# Altium schematic sheet Brain-PCB_Master.SchDoc
size C; SheetNumber: 1; SheetTotal: 1
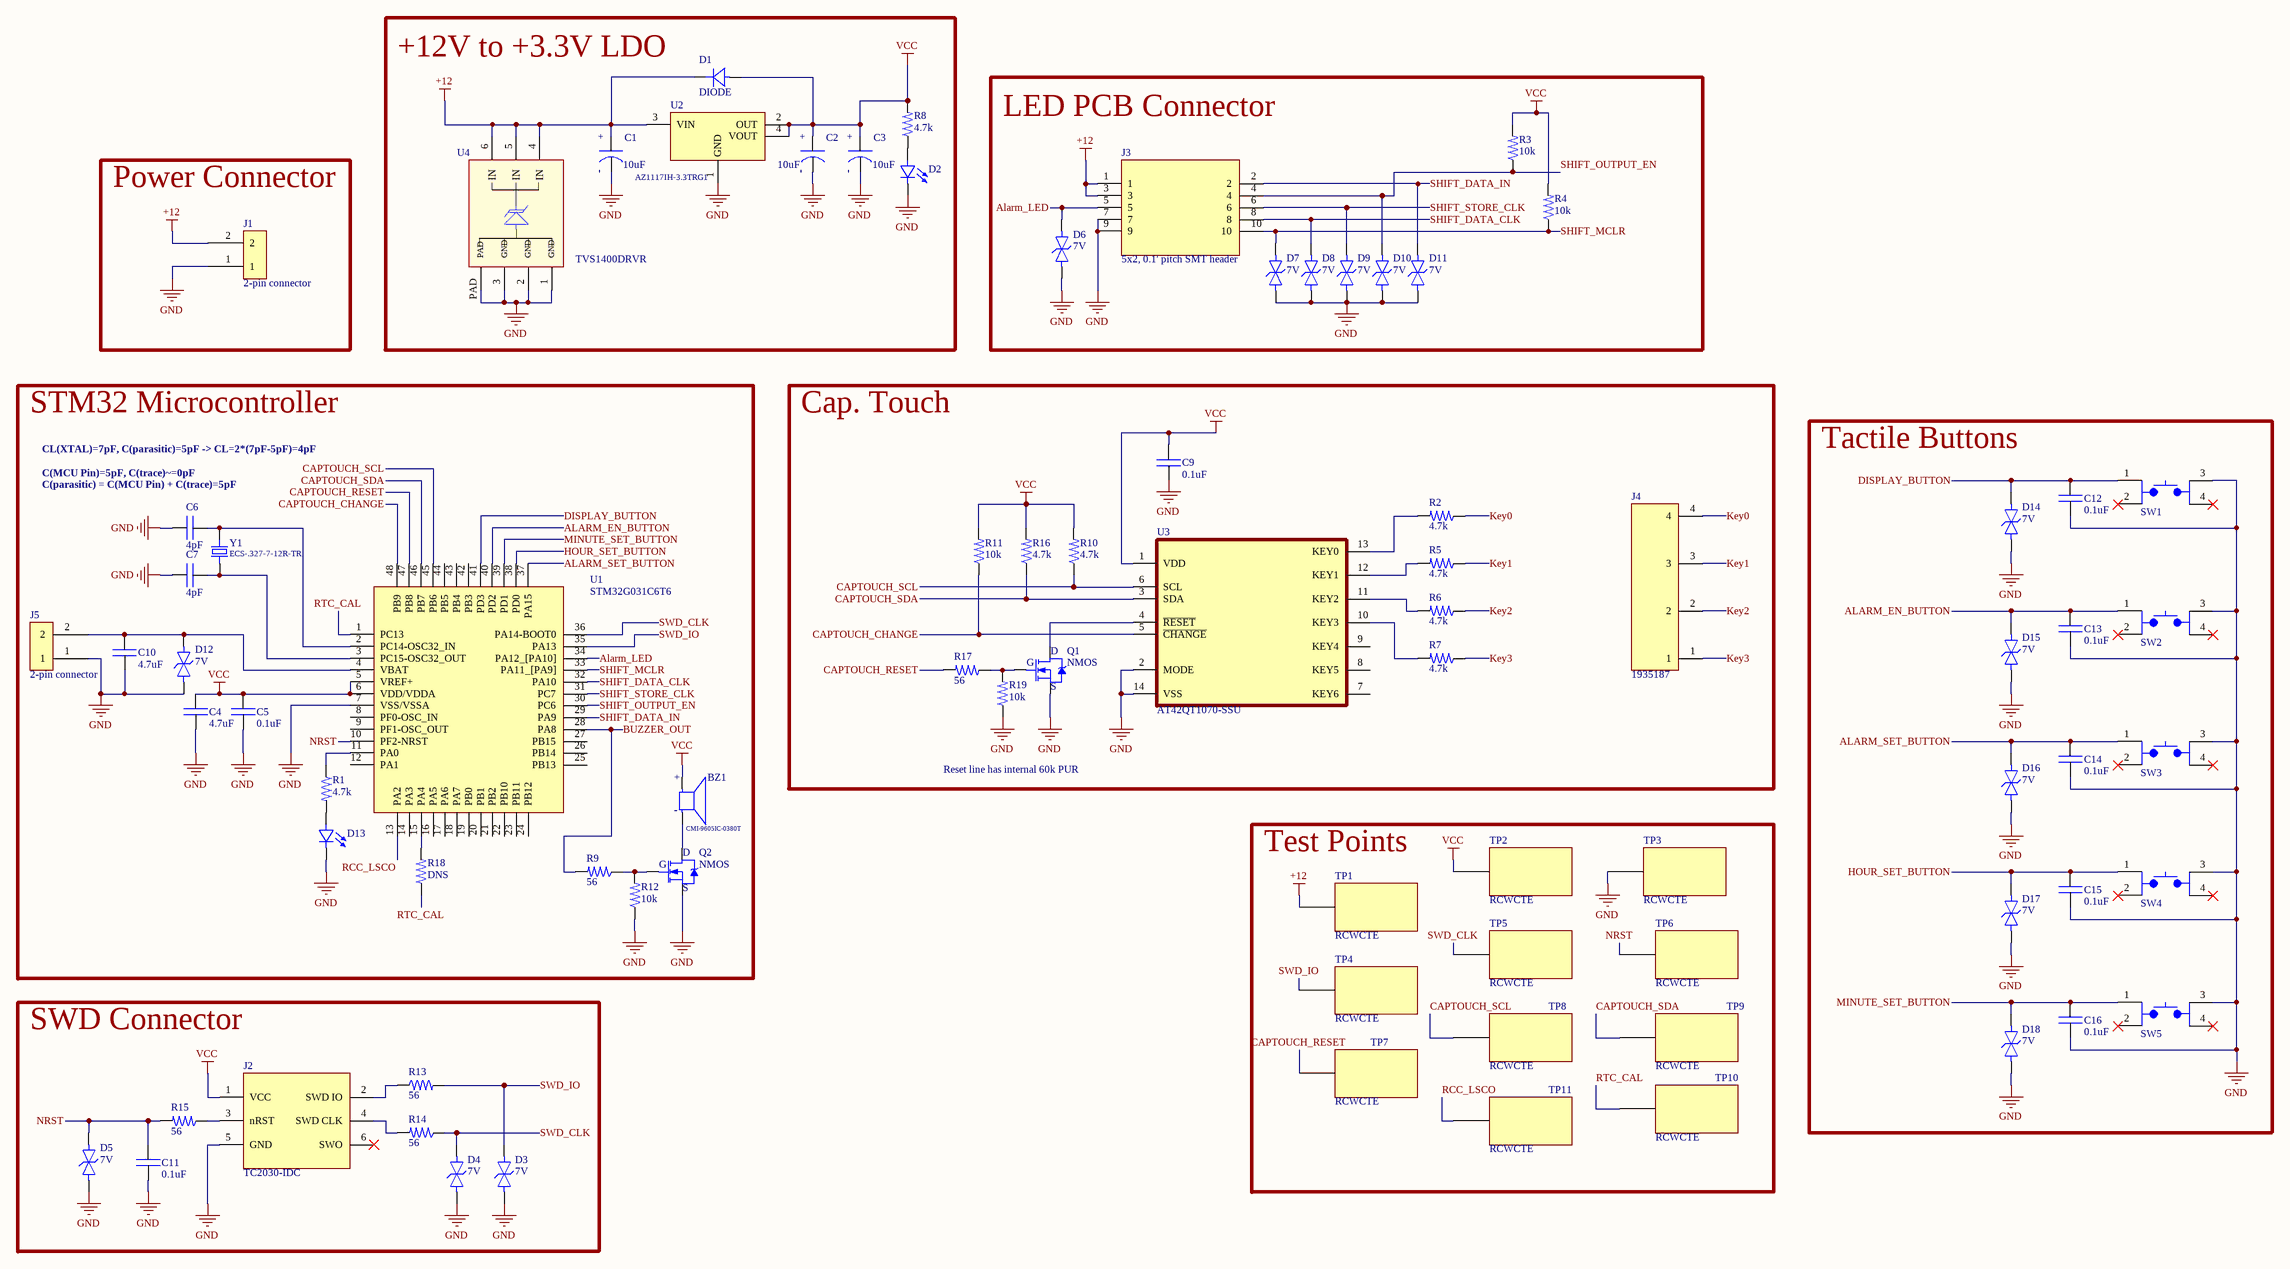
[diagram p0: Brain-PCB_Master.SchDoc]

## Parts
BZ1  CMI-9605IC-0380T  [CUI_CMI-9605IC-0380T]
C1  value 10uF  [CAP_CAN_POLY]  (hidden comment: CAP)
C2  value 10uF  [CAP_CAN_POLY]  (hidden comment: CAP)
C3  value 10uF  [CAP_CAN_POLY]  (hidden comment: CAP)
C4  value 4.7uF  [0402C]  (hidden comment: CAP)
C5  value 0.1uF  [0402C]  (hidden comment: CAP)
C6  value 4pF  [0402C]  (hidden comment: CAP)
C7  value 4pF  [0402C]  (hidden comment: CAP)
C9  value 0.1uF  [0402C]  (hidden comment: CAP)
C10  value 4.7uF  [0402C]  (hidden comment: CAP)
C11  value 0.1uF  [0402C]  (hidden comment: CAP)
C12  value 0.1uF  [0402C]  (hidden comment: CAP)
C13  value 0.1uF  [0402C]  (hidden comment: CAP)
C14  value 0.1uF  [0402C]  (hidden comment: CAP)
C15  value 0.1uF  [0402C]  (hidden comment: CAP)
C16  value 0.1uF  [0402C]  (hidden comment: CAP)
D1  DIODE  [DO-214AC]
D2  LED - single  [LED - 0603]  (value not drawn)
D3  7V  [DESD3V3S1BL-7B]
D4  7V  [DESD3V3S1BL-7B]
D5  7V  [DESD3V3S1BL-7B]
D6  7V  [DESD3V3S1BL-7B]
D7  7V  [DESD3V3S1BL-7B]
D8  7V  [DESD3V3S1BL-7B]
D9  7V  [DESD3V3S1BL-7B]
D10  7V  [DESD3V3S1BL-7B]
D11  7V  [DESD3V3S1BL-7B]
D12  7V  [DESD3V3S1BL-7B]
D13  LED - single  [LED - 0603]  (value not drawn)
D14  7V  [DESD3V3S1BL-7B]
D15  7V  [DESD3V3S1BL-7B]
D16  7V  [DESD3V3S1BL-7B]
D17  7V  [DESD3V3S1BL-7B]
D18  7V  [DESD3V3S1BL-7B]
J1  2-pin connector  [CONN_MOLEX_705510001]
J2  TC2030-IDC  [TAG CONNECT TC2030IDC - NO 3D MODEL]
J3  5x2, 0.1' pitch SMT header  [5x2, 0.1' pitch SMT header]
J4  1935187  [1935187]
J5  2-pin connector  [CONN_MOLEX_705510001]
Q1  NMOS  [SOT-23]
Q2  NMOS  [SOT-23]
R1  value 4.7k  [0402R]  (hidden comment: RES)
R2  value 4.7k  [0402R]  (hidden comment: RES)
R3  value 10k  [0402R]  (hidden comment: RES)
R4  value 10k  [0402R]  (hidden comment: RES)
R5  value 4.7k  [0402R]  (hidden comment: RES)
R6  value 4.7k  [0402R]  (hidden comment: RES)
R7  value 4.7k  [0402R]  (hidden comment: RES)
R8  value 4.7k  [0402R]  (hidden comment: RES)
R9  value 56  [0402R]  (hidden comment: RES)
R10  value 4.7k  [0402R]  (hidden comment: RES)
R11  value 10k  [0402R]  (hidden comment: RES)
R12  value 10k  [0402R]  (hidden comment: RES)
R13  value 56  [0402R]  (hidden comment: RES)
R14  value 56  [0402R]  (hidden comment: RES)
R15  value 56  [0402R]  (hidden comment: RES)
R16  value 4.7k  [0402R]  (hidden comment: RES)
R17  value 56  [0402R]  (hidden comment: RES)
R18  value DNS  [0402R]  (hidden comment: RES)
R19  value 10k  [0402R]  (hidden comment: RES)
SW1  SPDT SMT Tactile Push Button Switch  [TL3301BF160QGTUBE]  (value not drawn)
SW2  SPDT SMT Tactile Push Button Switch  [TL3301BF160QGTUBE]  (value not drawn)
SW3  SPDT SMT Tactile Push Button Switch  [TL3301BF160QGTUBE]  (value not drawn)
SW4  SPDT SMT Tactile Push Button Switch  [TL3301BF160QGTUBE]  (value not drawn)
SW5  SPDT SMT Tactile Push Button Switch  [TL3301BF160QGTUBE]  (value not drawn)
TP1  RCWCTE  [RCWCTE]
TP2  RCWCTE  [RCWCTE]
TP3  RCWCTE  [RCWCTE]
TP4  RCWCTE  [RCWCTE]
TP5  RCWCTE  [RCWCTE]
TP6  RCWCTE  [RCWCTE]
TP7  RCWCTE  [RCWCTE]
TP8  RCWCTE  [RCWCTE]
TP9  RCWCTE  [RCWCTE]
TP10  RCWCTE  [RCWCTE]
TP11  RCWCTE  [RCWCTE]
U1  STM32G031C6T6  [48-LQFP]
U2  AZ1117IH-3.3TRG1  [SOT-223-3]
U3  AT42QT1070-SSU  [14-SOIC]
U4  TVS1400DRVR  [6-WDFN-EP]
Y1  ECS-.327-7-12R-TR  [ECS-.327-12.5-12R-TR]

## Blocks framed on the sheet
+12V to +3.3V LDO: C1-C3 D1 D2 R8 U2 U4
LED PCB Connector: D6-D11 J3 R3 R4
Power Connector: J1
STM32 Microcontroller: BZ1 C4-C7 C10 D12 D13 J5 Q2 R1 R9 R12 R18 U1 Y1
Cap. Touch: C9 J4 Q1 R2 R5-R7 R10 R11 R16 R17 R19 U3
Tactile Buttons: C12-C16 D14-D18 SW1-SW5
Test Points: TP1-TP11
SWD Connector: C11 D3-D5 J2 R13-R15

## Nets
+12: C1.1 D1.K J1.2 J3.1 J3.3 TP1.1 U2.3(VIN) U4.4(IN) U4.5(IN) U4.6(IN)
GND: C1.2 C2.2 C3.2 C4.1 C5.1 C6.1 C7.1 C9.1 C10.1 C11.1 C12.1 C13.1 C14.1 C15.1 C16.1 D2.2(C) D3.2 D4.2 D5.2 D6.2 D7.2 D8.2 D9.2 D10.2 D11.2 D12.2 D13.2(C) D14.2 D15.2 D16.2 D17.2 D18.2 J1.1 J2.5(GND) J3.7 J3.9 J5.1 Q1.2(S) Q2.2(S) R12.1 R19.1 SW1.3 SW2.3 SW3.3 SW4.3 SW5.3 TP3.1 U1.7(VSS/VSSA) U2.1(GND) U3.2(MODE) U3.14(VSS) U4.1(GND) U4.2(GND) U4.3(GND) U4.PAD
VCC: BZ1.P C2.1 C3.1 C4.2 C5.2 C9.2 D1.A J2.1(VCC) R3.2 R4.2 R8.2 R10.2 R11.2 R16.2 TP2.1 U1.5(VREF+) U1.6(VDD/VDDA) U2.2(OUT) U2.4(VOUT) U3.1(VDD)
ALARM_EN_BUTTON: C13.2 D15.1 SW2.1 U1.40(PD2)
Alarm_LED: D6.1 J3.5 U1.34(PA12_[PA10])
ALARM_SET_BUTTON: C14.2 D16.1 SW3.1 U1.37(PA15)
BUZZER_OUT: R9.2 U1.28(PA8)
CAPTOUCH_CHANGE: R11.1 U1.48(PB9) U3.5(~{CHANGE})
CAPTOUCH_RESET: R17.2 TP7.1 U1.47(PB8)
CAPTOUCH_SCL: R10.1 TP8.1 U1.45(PB6) U3.6(SCL)
CAPTOUCH_SDA: R16.1 TP9.1 U1.46(PB7) U3.3(SDA)
DISPLAY_BUTTON: C12.2 D14.1 SW1.1 U1.41(PD3)
HOUR_SET_BUTTON: C15.2 D17.1 SW4.1 U1.38(PD0)
Key0: J4.4 R2.1
Key1: J4.3 R5.1
Key2: J4.2 R6.1
Key3: J4.1 R7.1
MINUTE_SET_BUTTON: C16.2 D18.1 SW5.1 U1.39(PD1)
NRST: C11.2 D5.1 R15.2 TP6.1 U1.10(PF2-NRST)
RCC_LSCO: TP11.1 U1.13(PA2)
RTC_CAL: R18.1 TP10.1 U1.1(PC13)
SHIFT_DATA_CLK: D8.1 J3.8 U1.32(PA10)
SHIFT_DATA_IN: D11.1 J3.2 U1.29(PA9)
SHIFT_MCLR: D7.1 J3.10 R4.1 U1.33(PA11_[PA9])
SHIFT_OUTPUT_EN: D10.1 J3.4 R3.1 U1.30(PC6)
SHIFT_STORE_CLK: D9.1 J3.6 U1.31(PC7)
SWD_CLK: D4.1 R14.1 TP5.1 U1.36(PA14-BOOT0)
SWD_IO: D3.1 R13.2 TP4.1 U1.35(PA13)
NetBZ1_N: BZ1.N Q2.3(D)
NetC6_2: C6.2 U1.2(PC14-OSC32_IN) Y1.2
NetC7_2: C7.2 U1.3(PC15-OSC32_OUT) Y1.1
NetC10_2: C10.2 D12.1 J5.2 U1.4(VBAT)
NetD2_1: D2.1(A) R8.1
NetD13_1: D13.1(A) R1.2
NetJ2_2: J2.2(SWD_IO) R13.1
NetJ2_3: J2.3(nRST) R15.1
NetJ2_4: J2.4(SWD_CLK) R14.2
NetQ1_1: Q1.1(G) R17.1 R19.2
NetQ1_3: Q1.3(D) U3.4(~{RESET})
NetQ2_1: Q2.1(G) R9.1 R12.2
NetR1_1: R1.1 U1.11(PA0)
NetR2_2: R2.2 U3.13(KEY0)
NetR5_2: R5.2 U3.12(KEY1)
NetR6_2: R6.2 U3.11(KEY2)
NetR7_2: R7.2 U3.10(KEY3)
NetR18_2: R18.2 U1.15(PA4)

Not connected (* = marked no-connect by the designer): J2 6(SWO)*; SW1 2* 4*; SW2 2* 4*; SW3 2* 4*; SW4 2* 4*; SW5 2* 4*; U1 8(PF0-OSC_IN) 9(PF1-OSC_OUT) 12(PA1) 14(PA3) 16(PA5) 17(PA6) 18(PA7) 19(PB0) 20(PB1) 21(PB2) 22(PB10) 23(PB11) 24(PB12) 25(PB13) 26(PB14) 27(PB15) 42(PB3) 43(PB4) 44(PB5); U3 7(KEY6) 8(KEY5) 9(KEY4)

## Notes on the sheet
- CL(XTAL)=7pF, C(parasitic)=5pF -> CL=2*(7pF-5pF)=4pF
- C(MCU Pin)=5pF, C(trace)~=0pF
- C(parasitic) = C(MCU Pin) + C(trace)=5pF
- Reset line has internal 60k PUR
- (in symbol CAP - POLARIZED) +; -
- (in symbol CMI-9605IC-0380T) +; -

## Library data of the parts
BZ1 = CMI-9605IC-0380T: MAGNETIC BUZZER INDICATOR; MFR: CUI Devices; MFR PN: CMI-9605IC-0380T; Type: TH
C1-C3 = CAP - POLARIZED: Capacitor; MFR: Würth Elektronik; MFR PN: 865080642006; Type: SMD; Vendor: *; Vendor PN: *; Vendor Link: *; ClassName: PWR
C4 C10 = CAP: Capacitor; MFR: Samsung Electro-Mechanics; MFR PN: CL05A475KQ5NRNC; Vendor: DigiKey; Vendor PN: 1276-6796-1-ND; Type: SMD; Vendor Link: https://www.digikey.com/en/products/detail/samsung-electro-mechanics/CL05A105KL5NRNC/5961280
C5 C9 C11-C16 = CAP: Capacitor; MFR: Samsung Electro-Mechanics; MFR PN: CL05A104KP5NNNC; Vendor: DigiKey; Vendor PN: 1276-1022-1-ND; Type: SMD; Vendor Link: https://www.digikey.com/en/products/detail/samsung-electro-mechanics/CL05A104KP5NNNC/3886680
  C9: ClassName: CTOUCH
C6 C7 = CAP: Capacitor; MFR: YAGEO; MFR PN: CC0402CRNPO9BN4R0; Type: SMD
D1 = DIODE: DIODE GEN PURP; MFR: Micro Commercial Co; MFR PN: GS1M-LTP; Type: SMD; Value: *; ClassName: PWR
D2 D13 = LED - single: LED; MFR: Dialight; MFR PN: 5988070107F; Color: Green; Vendor: DigiKey; Vendor PN: 350-2035-1-ND; Type: SMD; Vendor Link: https://www.digikey.com/en/products/detail/dialight/5988070107F/1291269; ClassName: PWR
D3-D12 D14-D18 = TVS Diode Bi: MFR PN: DESD3V3E1BL-7B; MFR: Diodes Incorporated; Type: SMD
J1 J5 = 2-pin connector: CONN HEADER R/A 2POS 2.54MM; MFR: MOLEX; MFR PN: 0705510001; Vendor: *; Vendor PN: *; Vendor Link: *; Type: TH
J2 = TC2030-IDC: "Plug of Nails" POGO Pin connector; MFR PN: TC2030-IDC-NL; MFR: Tag-Connect; Value: DNS
J3 = 5x2, 0.1' pitch SMT header: CONN HEADER SMD 10POS 2.54MM; MFR: CNC Tech; MFR PN: 3020-10-0300-00; Type: SMD
J4 = SCREW CONN 4 POS: Fixed Terminal Blocks PT 1.5/4-5.0-H; MFR: Phoenix Contact; MFR PN: 1935187; Type: TH
Q1 Q2 = NMOS: N-Channel MOSFET; MFR PN: DMN63D8L-7; MFR: Diodes Incorporated; Type: SMD; Vendor: *; Vendor PN: *; Vendor Link: *
R1 R2 R5-R8 R10 R16 = RES: Resistor; MFR PN: AC0402FR-134K7L; MFR: YAGEO; Vendor: *; Vendor PN: *; Vendor Link: *; Type: SMD
  R1 R2 R5-R7 R10 R16: ClassName: CTOUCH
  R8: ClassName: PWR
R3 R4 R11 R12 R19 = RES: Resistor; MFR: YAGEO; MFR PN: RC0402JR-0710KL; Vendor: DigiKey; Vendor PN: 311-10KJRCT-ND; Vendor Link: https://www.digikey.com/en/products/detail/yageo/RC0402JR-0710KL/726418; Type: SMD
  R11 R19: ClassName: CTOUCH
R9 R13-R15 R17 = RES: Resistor; MFR: YAGEO; MFR PN: RC0402FR-0756RL; Vendor: DigiKey; Vendor PN: 311-56.0LRCT-ND; Vendor Link: https://www.digikey.com/en/products/detail/yageo/RC0402FR-0756RL/726636; Type: SMD
  R9 R13-R15: ClassName: PWR
  R17: ClassName: CTOUCH
R18 = RES: Resistor; MFR PN: *; MFR: *; Vendor: *; Vendor PN: *; Vendor Link: *; Type: SMD
SW1-SW5 = SPDT SMT Tactile Push Button Switch: Tactile Push Button Switch, Gull Wing Lead, 9.5mm contact height; MFR: E-Switch; MFR PN: TL3301BF160QG; Vendor: DigiKey; Vendor PN: 141-TL3301BF160QGTUBE-ND; Vendor Link: https://www.digikey.com/en/products/detail/e-switch/TL3301BF160QGTUBE/1805543; Type: SMD
TP1-TP11 = Test Point: Test Point, Surface Mount; MFR: KOA Speer Electronics, Inc.; Value: DNS; MFR PN: RCWCTE; Type: SMD
U1 = STM32G031C6T6: STM32G031C6T6 - ARM MCU, STM32 Family STM32G0 Series Microcontrollers, ARM Cortex-M0+, 32bit, 64 MHz, 32 KB, 8 KB; MFR: STMicroelectronics; MFR PN: STM32G031C6T6; Type: SMD
U2 = AZ1117IH-3.3TRG1: IC REG LINEAR 3.3V 1A SOT223; MFR: Diodes Incorporated; MFR PN: AZ1117IH-3.3TRG1; Type: SMD
U3 = AT42QT1070-SSU: Capacitive Touch Buttons 14-SOIC; MFR: Microchip; Value: *; MFR PN: AT42QT1070-SSU; Type: SMD
U4 = TVS1400DRVR: UNIDIR  PRECISION SURGE DIODE; MFR: Texas Instruments; MFR PN: TVS1400DRVR; Value: *; Type: SMD
Y1 = ECS-.327-7-12R-TR: SMD Tuning Fork Crystal; MFR: ECS Inc.; MFR PN: ECS-.327-7-12R-TR; Type: SMD